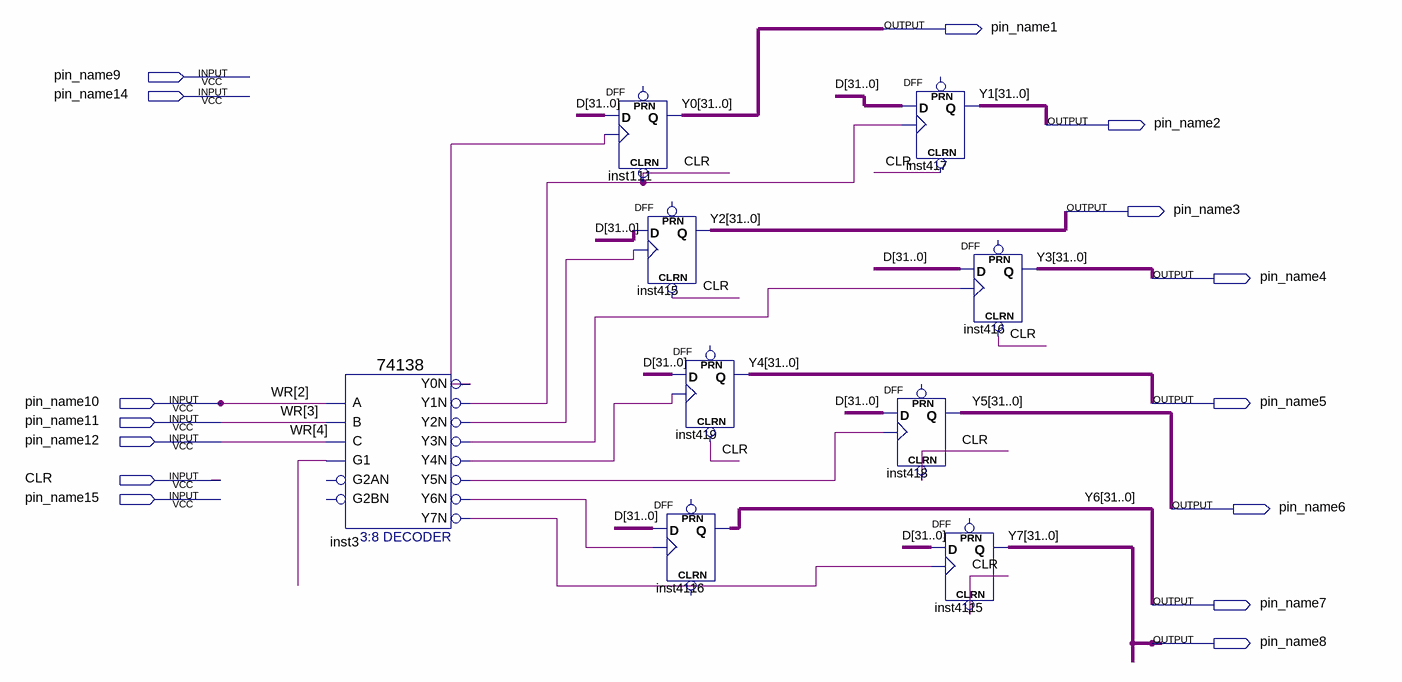
[diagram p0: schematic sheet]
// Quartus schematic Block.bdf as structural Verilog: 9 symbols, 15 pins
module Block (
  input  pin_name9,
  input  pin_name14,
  input  pin_name10,
  input  pin_name11,
  input  pin_name12,
  input  CLR,
  input  pin_name15,
  output pin_name1,
  output pin_name2,
  output pin_name3,
  output pin_name4,
  output pin_name5,
  output pin_name6,
  output pin_name7,
  output pin_name8
);

  wire inst3_y0n, inst3_y2n, inst3_y3n, inst3_y4n, inst3_y5n, inst3_y6n, inst3_y7n, undriven;
  wire [31:0] D, Y0, Y1, Y2, Y3, Y4, Y5, Y6, Y7;

  \74138  inst3 (
    .A(pin_name10), .B(pin_name11), .G1(undriven), .C(pin_name12), .Y0N(inst3_y0n), .Y1N(CLR),
    .Y2N(inst3_y2n), .Y3N(inst3_y3n), .Y4N(inst3_y4n), .Y5N(inst3_y5n), .Y6N(inst3_y6n), .Y7N(inst3_y7n));  // open: G2AN, G2BN
  DFF inst111[31:0] (.CLRN(CLR), .CLK(inst3_y0n), .D(D), .Q(Y0));  // open: PRN
  DFF inst415[31:0] (.CLRN(CLR), .CLK(inst3_y2n), .D(D), .Q(Y2));  // open: PRN
  DFF inst4116[31:0] (.CLK(inst3_y6n), .D(D), .Q(Y6));  // open: CLRN, PRN
  DFF inst419[31:0] (.CLRN(CLR), .CLK(inst3_y4n), .D(D), .Q(Y4));  // open: PRN
  DFF inst418[31:0] (.CLRN(CLR), .CLK(inst3_y5n), .D(D), .Q(Y5));  // open: PRN
  DFF inst417[31:0] (.CLRN(CLR), .CLK(CLR), .D(D), .Q(Y1));  // open: PRN
  DFF inst416[31:0] (.CLRN(CLR), .CLK(inst3_y3n), .D(D), .Q(Y3));  // open: PRN
  DFF inst4115[31:0] (.CLRN(CLR), .CLK(inst3_y7n), .D(D), .Q(Y7));  // open: PRN

  // Other names for the same wires on the sheet: WR[4:2] = {pin_name12, pin_name11, pin_name10}
endmodule
